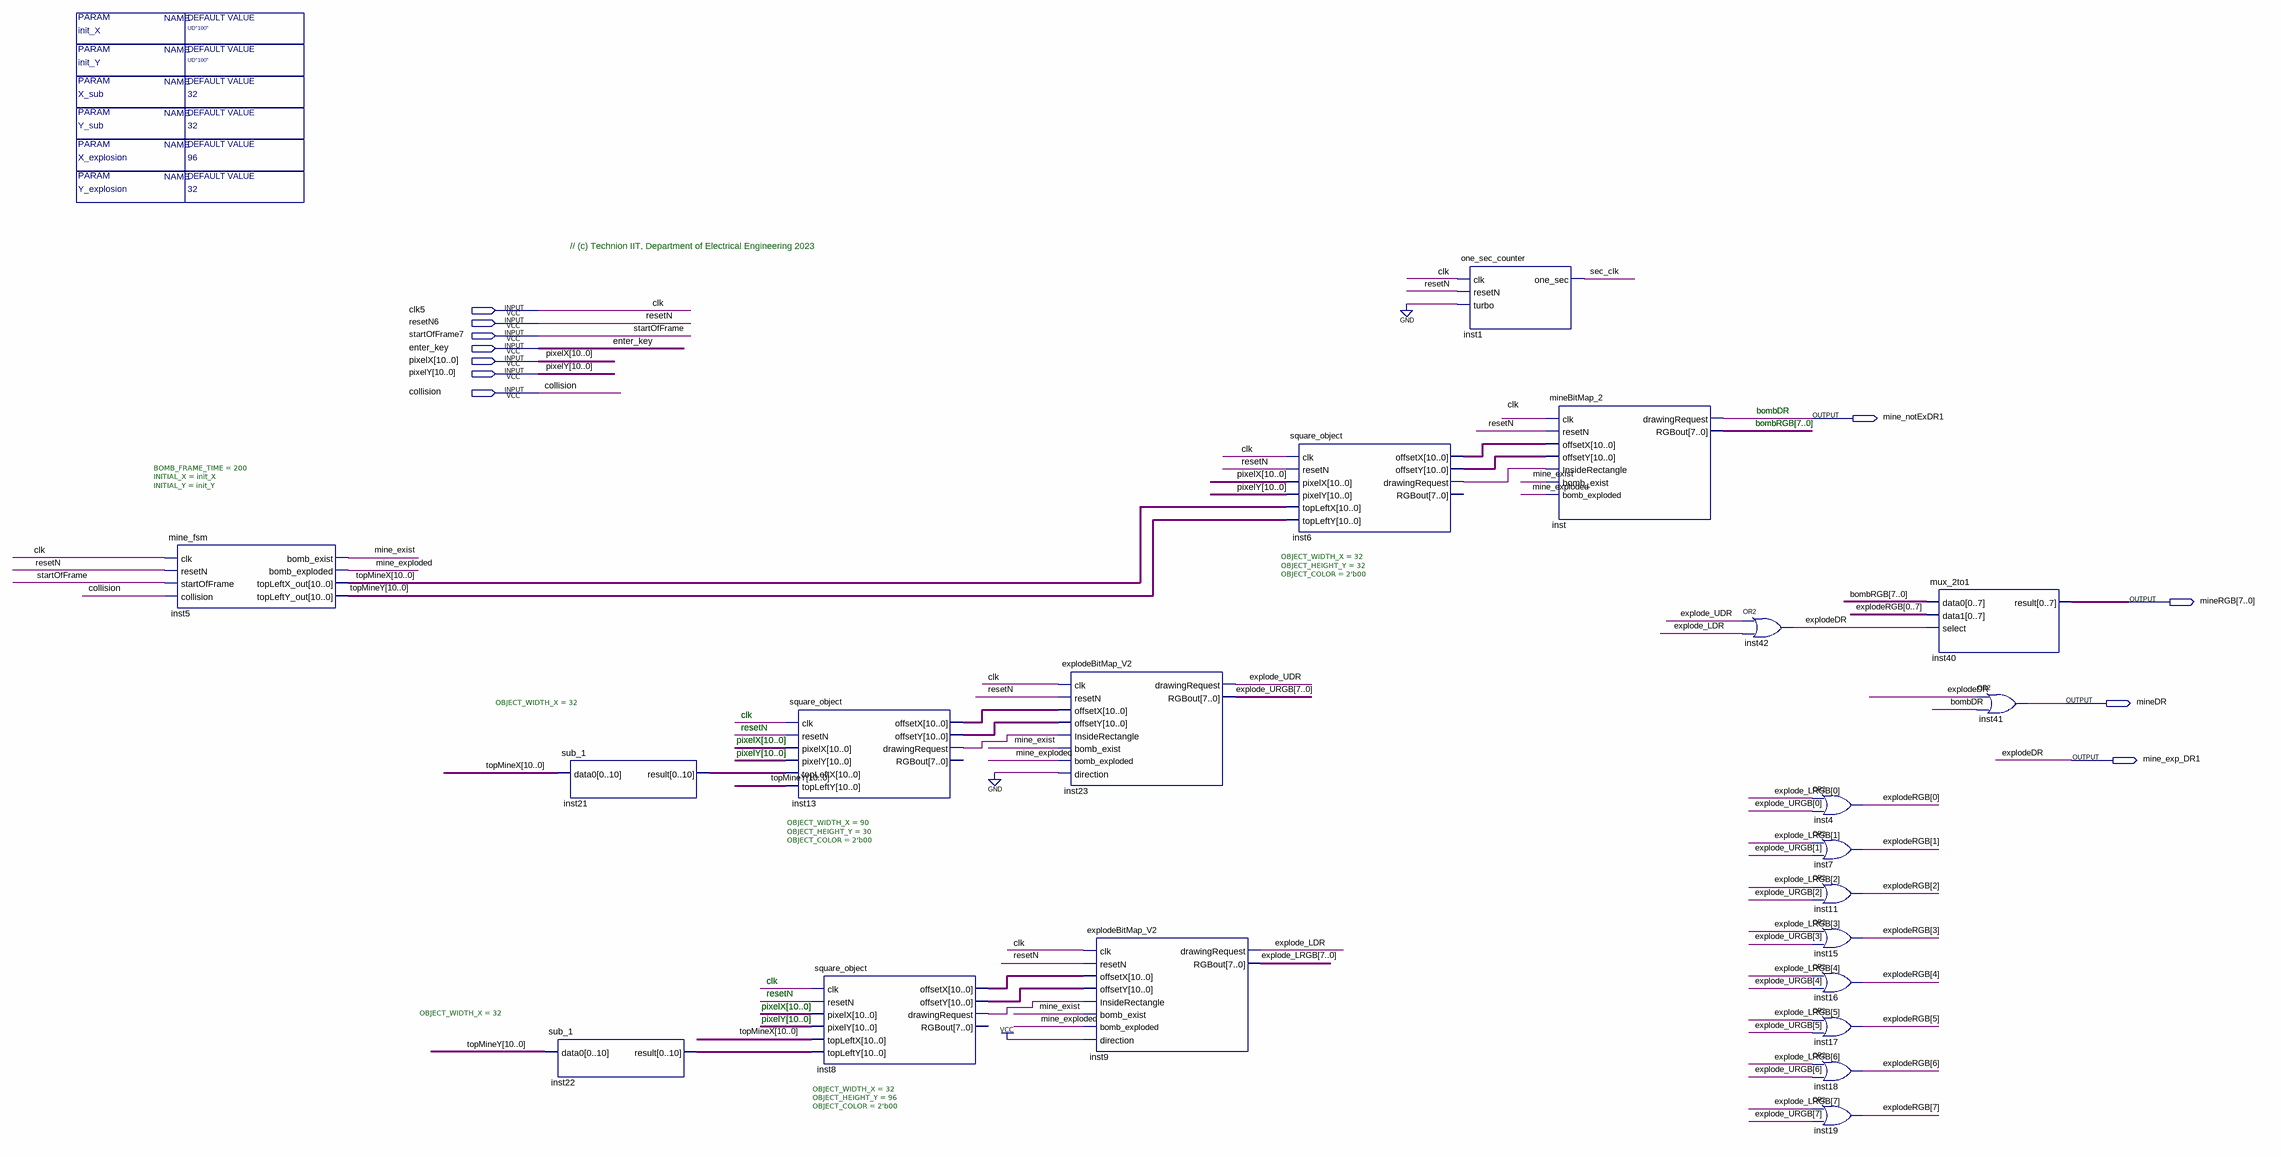
[diagram p0: schematic sheet]
// Quartus schematic mine_2_Block_T.bdf as structural Verilog: 21 symbols, 11 pins
module mine_2_Block_T #(parameter init_X = "UD\"100\"", parameter init_Y = "UD\"100\"", parameter X_explosion = 96, parameter Y_explosion = 32, parameter X_sub = 32, parameter Y_sub = 32) (
  input  clk5,
  input  resetN6,
  input  startOfFrame7,
  input  enter_key,
  input  [10:0] pixelX,
  input  [10:0] pixelY,
  input  collision,
  output mine_notExDR1,
  output [7:0] mineRGB,
  output mineDR,
  output mine_exp_DR1
);

  wire explode_LDR, explode_UDR, inst6_drawingrequest, inst8_drawingrequest, inst13_drawingrequest,
       mine_exist, mine_exploded, sec_clk;
  wire [7:0] bombRGB, explode_LRGB, explode_URGB, explodeRGB;
  wire [10:0] inst6_offsetx, inst6_offsety, inst8_offsetx, inst8_offsety, inst13_offsetx, inst13_offsety,
       inst21_result, inst22_result, topMineX, topMineY;

  mine_fsm #(.BOMB_FRAME_TIME(200), .INITIAL_X(init_X), .INITIAL_Y(init_Y)) inst5 (
    .clk(clk5), .resetN(resetN6), .startOfFrame(startOfFrame7), .collision(collision),
    .bomb_exist(mine_exist), .bomb_exploded(mine_exploded), .topLeftX_out(topMineX), .topLeftY_out(topMineY));
  sub_1 #(.OBJECT_WIDTH_X(32)) inst21 (.data0(topMineX), .result(inst21_result));
  sub_1 #(.OBJECT_WIDTH_X(32)) inst22 (.data0(topMineY), .result(inst22_result));
  square_object #(.OBJECT_WIDTH_X(90), .OBJECT_HEIGHT_Y(30), .OBJECT_COLOR(2'b00)) inst13 (
    .clk(clk5), .resetN(resetN6), .pixelX(pixelX), .pixelY(pixelY), .topLeftX(inst21_result),
    .topLeftY(topMineY), .offsetX(inst13_offsetx), .offsetY(inst13_offsety),
    .drawingRequest(inst13_drawingrequest));  // open: RGBout
  square_object #(.OBJECT_WIDTH_X(32), .OBJECT_HEIGHT_Y(96), .OBJECT_COLOR(2'b00)) inst8 (
    .clk(clk5), .resetN(resetN6), .pixelX(pixelX), .pixelY(pixelY), .topLeftX(topMineX),
    .topLeftY(inst22_result), .offsetX(inst8_offsetx), .offsetY(inst8_offsety),
    .drawingRequest(inst8_drawingrequest));  // open: RGBout
  explodeBitMap_V2 inst23 (
    .clk(clk5), .resetN(resetN6), .offsetX(inst13_offsetx), .offsetY(inst13_offsety),
    .InsideRectangle(inst13_drawingrequest), .bomb_exist(mine_exist), .bomb_exploded(mine_exploded),
    .direction(1'b0), .drawingRequest(explode_UDR), .RGBout(explode_URGB));
  explodeBitMap_V2 inst9 (
    .clk(clk5), .resetN(resetN6), .offsetX(inst8_offsetx), .offsetY(inst8_offsety),
    .InsideRectangle(inst8_drawingrequest), .bomb_exist(mine_exist), .bomb_exploded(mine_exploded),
    .direction(1'b1), .drawingRequest(explode_LDR), .RGBout(explode_LRGB));
  square_object #(.OBJECT_WIDTH_X(32), .OBJECT_HEIGHT_Y(32), .OBJECT_COLOR(2'b00)) inst6 (
    .clk(clk5), .resetN(resetN6), .pixelX(pixelX), .pixelY(pixelY), .topLeftX(topMineX), .topLeftY(topMineY),
    .offsetX(inst6_offsetx), .offsetY(inst6_offsety), .drawingRequest(inst6_drawingrequest));  // open: RGBout
  one_sec_counter inst1 (.clk(clk5), .resetN(resetN6), .turbo(1'b0), .one_sec(sec_clk));
  mineBitMap_2 inst (
    .clk(clk5), .resetN(resetN6), .offsetX(inst6_offsetx), .offsetY(inst6_offsety),
    .InsideRectangle(inst6_drawingrequest), .bomb_exist(mine_exist), .bomb_exploded(mine_exploded),
    .drawingRequest(mine_notExDR1), .RGBout(bombRGB));
  or inst42 (mine_exp_DR1, explode_UDR, explode_LDR);
  or inst4 (explodeRGB[0], explode_LRGB[0], explode_URGB[0]);
  or inst7 (explodeRGB[1], explode_LRGB[1], explode_URGB[1]);
  or inst11 (explodeRGB[2], explode_LRGB[2], explode_URGB[2]);
  or inst15 (explodeRGB[3], explode_LRGB[3], explode_URGB[3]);
  or inst16 (explodeRGB[4], explode_LRGB[4], explode_URGB[4]);
  or inst17 (explodeRGB[5], explode_LRGB[5], explode_URGB[5]);
  or inst18 (explodeRGB[6], explode_LRGB[6], explode_URGB[6]);
  or inst19 (explodeRGB[7], explode_LRGB[7], explode_URGB[7]);
  mux_2to1 inst40 (
    .data0(bombRGB),
    .data1({explodeRGB[0], explodeRGB[1], explodeRGB[2], explodeRGB[3], explodeRGB[4], explodeRGB[5], explodeRGB[6], explodeRGB[7]}),
    .select(mine_exp_DR1), .result(mineRGB));
  or inst41 (mineDR, mine_exp_DR1, mine_notExDR1);

  // Other names for the same wires on the sheet: bombDR = mine_notExDR1; clk = clk5; explodeDR = mine_exp_DR1;
  //   resetN = resetN6; startOfFrame = startOfFrame7

  // Notes on the sheet:
  //   // (c) Technion IIT, Department of Electrical Engineering 2023
  //   bombDR
  //   bombRGB[7..0]
  //   clk
  //   resetN
  //   pixelX[10..0]
  //   pixelY[10..0]
  //   clk
  //   resetN
  //   pixelX[10..0]
  //   pixelY[10..0]
endmodule
